# EAGLE design LoRa-PCB (EAGLE 7.5.0)
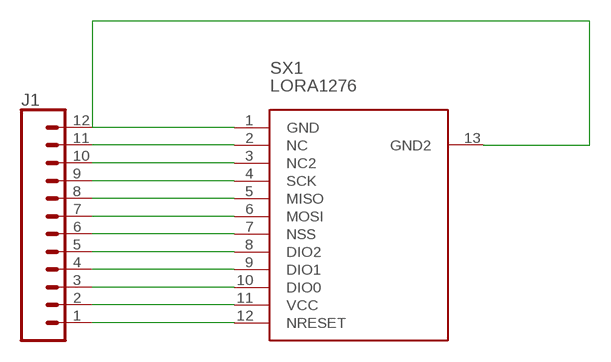
[diagram p0: schematic, sheet 1]

## Parts
J1  CONN_12  [1X12]
SX1  LORA1276  [PCBV2]

## Nets
N$1: J1.12 SX1.1(GND) SX1.13(GND2)
N$2: J1.11 SX1.2(NC)
N$3: J1.10 SX1.3(NC2)
N$4: J1.9 SX1.4(SCK)
N$5: J1.8 SX1.5(MISO)
N$6: J1.7 SX1.6(MOSI)
N$7: J1.6 SX1.7(NSS)
N$8: J1.5 SX1.8(DIO2)
N$9: J1.4 SX1.9(DIO1)
N$10: J1.3 SX1.10(DIO0)
N$11: J1.2 SX1.11(VCC)
N$12: J1.1 SX1.12(NRESET)

## Library data of the parts
J1 = SparkFun-Connectors:CONN_12: Multi connection point. Often used as Generic Header-pin footprint for 0.1 inch spaced/style header connections On any of the 0.1 inch spaced packages, you can populate with these: Break Away Headers - Straight <https://www.sparkfun.com/products/116> (PRT-00116) Break Away Male Headers - Right Angle <https://www.sparkfun.com/products/553> (PRT-00553) Female Headers <https://www.sparkfun.com/products/115> (PRT-00115) Break Away Headers - Machine Pin <https://www.sparkfun.com/products/117> (PRT-00117) Break Away Female Headers - Swiss Machine Pin <https://www.sparkfun.com/products/743> (PRT-00743) For SCREWTERMINALS and SPRING TERMINALS visit here: Screw Terimnals on SparkFun.com <https://www.sparkfun.com/search/results?term=Screw+Terminals> (5mm/3.5mm/2.54mm spacing) This device is also useful as a general connection point to wire up your design to another part of your project. Our various solder wires solder well into these plated through hole pads. Hook-Up Wire - Assortment (Stranded, 22 AWG) <https://www.sparkfun.com/products/11375> (PRT-11375) Hook-Up Wire - Assortment (Solid Core, 22 AWG) <https://www.sparkfun.com/products/11367> (PRT-11367) View the entire wire category on our website here <https://www.sparkfun.com/categories/141> Special notes: Molex polarized connector foot print use with SKU : PRT-08231 with associated crimp pins and housings. 1MM SMD Version SKU: PRT-10208 NOTES ON THE VARIANTS LOCK and LOCK_LONGPADS... This footprint was designed to help hold the alignment of a through-hole component (i.e. 6-pin header) while soldering it into place. You may notice that each hole has been shifted either up or down by 0.005 of an inch from it's more standard position (which is a perfectly straight line). This slight alteration caused the pins (the squares in the middle) to touch the edges of the holes. Because they are alternating, it causes a "brace" to hold the component in place. 0.005 has proven to be the perfect amount of "off-center" position when using our standard breakaway headers. Although looks a little odd when you look at the bare footprint, once you have a header in there, the alteration is very hard to notice. Also,if you push a header all the way into place, it is covered up entirely on the bottom side.
SX1 = Lora1276V2NiceRF:LORA1276

## Board
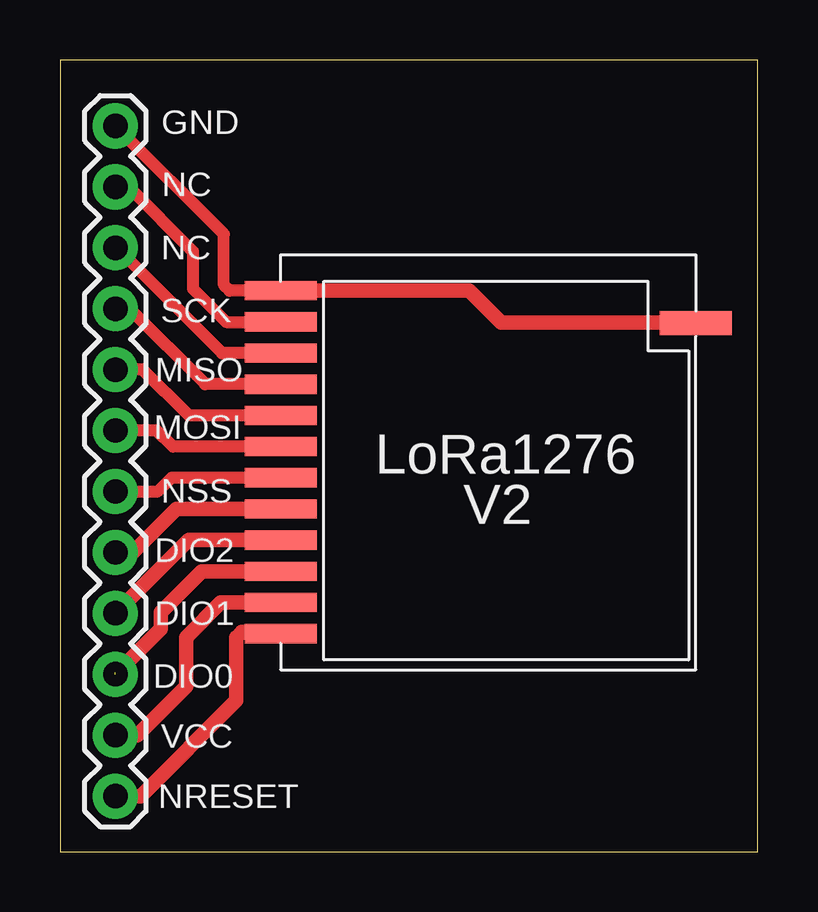
[diagram p1: board, top side]

Size 29.07 x 33 mm. Coordinates in mm from the lower left corner, seen from the top.
Outline: 0,0 29.07,0 29.07,33 0,33 0,0
Copper layers (1*16): Top 0.035mm / dielectric 1.5mm / Bottom 0.035mm
Design rules "default": minimum track width 10mil, minimum drill 24mil, track to track 8mil, track to pad 8mil, pad to pad 8mil, via to via 8mil, smd to smd 8mil, copper to edge 40mil, drill to drill 8mil, minimum pad ring 10mil, minimum via ring 8mil, stop-mask expansion 4mil, vias tented up to drill 0mil, thermal gap 10mil

### Footprints (pad centres in the part's own frame; a part is rotated, then mirrored left to right if it is on the bottom)
1X12 = drill 1.016 pad 1.88: 1 0,0; 2 2.54,0; 3 5.08,0; 4 7.62,0; 5 10.16,0; 6 12.7,0; 7 15.24,0; 8 17.78,0; 9 20.32,0; 10 22.86,0; 11 25.4,0; 12 27.94,0
PCBV2 = smd 3 x 0.8: 1 1.5,-0.4; 2 1.5,-1.7; 3 1.5,-3; 4 1.5,-4.3; 5 1.5,-5.6; 6 1.5,-6.9; 7 1.5,-8.2; 8 1.5,-9.5; 9 1.5,-10.8; 10 1.5,-12.1; 11 1.5,-13.4; 12 1.5,-14.7 | smd 3 x 1: 13 18.8,-1.75

### Placement (x,y rotation side)
J1  2.31,2.31 90 top
SX1  7.7,23.78 0 top

### Tracks (layer width: path | path; a pad name or v marks a point on that pad's centre or on a via)
N$1
  Top 0.5: SX1.1 7.07,23.38 6.83,23.62 6.83,25.73 J1.12
  Top 0.61: 25.95,22.05 SX1.13 26.48,22.05 18.38,22.05 17.05,23.38 SX1.1
N$2
  Top 0.5: J1.11 2.86,27.71 5.55,25.02 5.55,23.45 6.92,22.08 SX1.2
N$3
  Top 0.5: SX1.3 6.75,20.78 2.36,25.17 J1.10
N$4
  Top 0.5: SX1.4 6.04,19.48 2.9,22.62 J1.9
N$5
  Top 0.5: SX1.5 5.36,18.18 3.44,20.1 J1.8
N$6
  Top 0.5: SX1.6 4.7,16.88 4.02,17.56 J1.7
N$7
  Top 0.5: SX1.7 4.64,15.58 4.05,14.99 2.33,14.99 J1.6
N$8
  Top 0.61: SX1.8 4.84,14.28 3.03,12.47 J1.5
N$9
  Top 0.61: SX1.9 5.36,12.98 J1.4
N$10  (1 unrouted)
  Top 0.61: SX1.10 5.91,11.68 4.2,9.97 4.2,9.28 J1.3
N$11
  Top 0.61: SX1.11 6.71,10.38 5.25,8.93 5.25,6.88 3.22,4.85 J1.2
N$12
  Top 0.61: J1.1 3.36,2.31 7.35,6.3 7.35,8.93 7.36,8.93 7.58,9.15 8.6,9.15 SX1.12

### Text on the board
tPlace: GND | NC | NC | SCK | MISO | MOSI | LoRa1276 | NSS | V2 | DIO2 | DIO1 | DIO0 | VCC | NRESET